# Altium project car BMS.PrjPcb
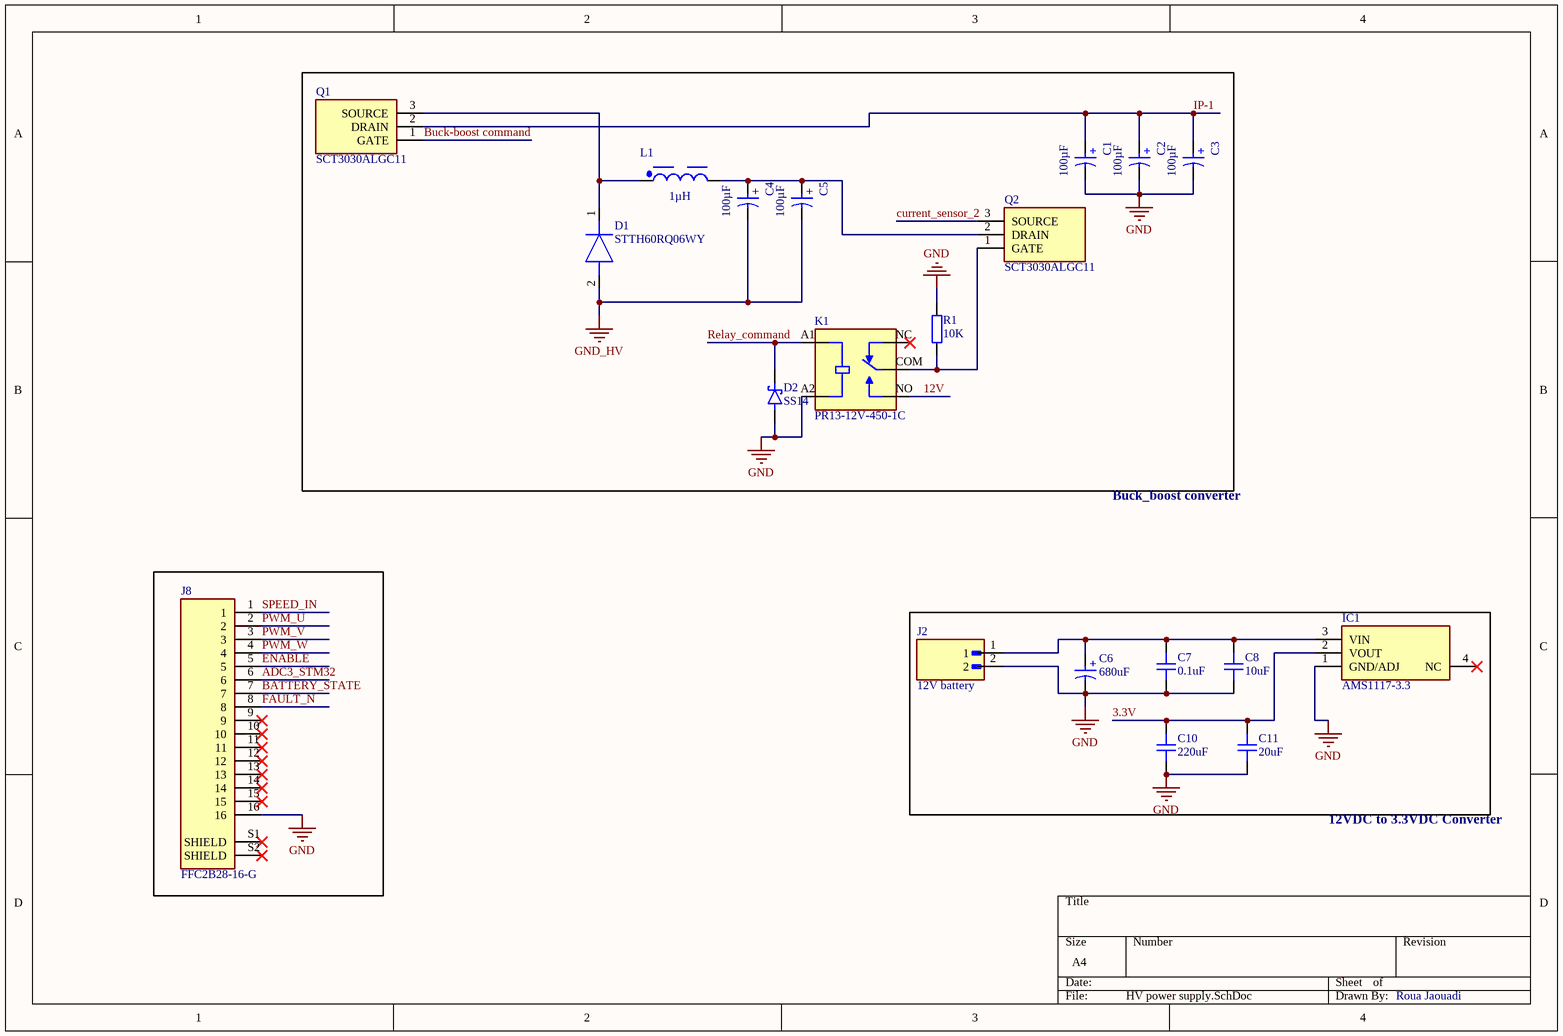
[diagram p0: HV power supply.SchDoc]
4 sheets, 108 parts. Net scope: global (net labels, ports and power ports of the same name join across sheets).
Board file: BMS_PCB.PcbDoc
Sheets:
  HV power supply.SchDoc
  CPU.SchDoc
  Switch mode power supply.SchDoc
  Current sensors.SchDoc

## Sheet HV power supply.SchDoc
size A4; SheetNumber: 1; SheetTotal: 4

### Parts
C1  100µF  [WCAP-AT1H_D16H35.5]
C2  100µF  [WCAP-AT1H_D16H35.5]
C3  100µF  [WCAP-AT1H_D16H35.5]
C4  100µF  [WCAP-AT1H_D16H35.5]
C5  100µF  [WCAP-AT1H_D16H35.5]
C6  680uF  [WCAP-ATG8_D8H16]
C7  0.1uF  [CAP_0603]
C8  10uF  [CAP_1206]
C10  220uF  [CAP-EL-NP-5MM]
C11  20uF  [CAP_1206]
D1  STTH60RQ06WY  [TO1090P515X1560X2445-2P]
D2  SS14  [DIOM4325X250N]
IC1  AMS1117-3.3  [SOT229P700X180-4N]
J2  12V battery  [JST_S2B-XH-A(LF)(SN)]
J8  FFC2B28-16-G  [GCT_FFC2B28-16-G]
K1  PR13-12V-450-1C  [RELAY_PR13-12V-450-1C]
L1  1µH  [WE-HCFT_2504_7443762504010]
Q1  SCT3030ALGC11  [TO545P515X1600X2535-3P]
Q2  SCT3030ALGC11  [TO545P515X1600X2535-3P]
R1  10K  [RES_0603]

### Nets
GND: C1.2(N) C2.2(N) C3.2(N) C6.2(N) C7.2 C8.2 C10.2 C11.2 D2.A IC1.1(GND/ADJ) J2.2 J8.16 K1.A2(COIL2) R1.1
GND_HV: C4.2(N) C5.2(N) D1.2(A)
3.3V: C10.1 C11.1 IC1.2(VOUT)
12V: K1.NO
ADC3_STM32: J8.6
BATTERY_STATE: J8.7
Buck-boost command: Q1.1(GATE)
current_sensor_2: Q2.3(SOURCE)
ENABLE: J8.5
FAULT_N: J8.8
IP-1: C1.1(P) C2.1(P) C3.1(P) Q1.2(DRAIN)
PWM_U: J8.2
PWM_V: J8.3
PWM_W: J8.4
Relay_command: D2.C(K) K1.A1(COIL1)
SPEED_IN: J8.1
NetC4_1: C4.1(P) C5.1(P) L1.2 Q2.2(DRAIN)
NetC6_1: C6.1(P) C7.1 C8.1 IC1.3(VIN) J2.1
NetD1_1: D1.1(K) L1.1 Q1.3(SOURCE)
NetK1_COM: K1.COM Q2.1(GATE) R1.2

Not connected (* = marked no-connect by the designer): IC1 4(NC)*; J8 9* 10* 11* 12* 13* 14* 15* S1(SHIELD)* S2(SHIELD)*; K1 NC*

### Notes on the sheet
- Buck_boost converter
- 12VDC to 3.3VDC Converter
- Roua Jaouadi
- (in symbol 860010374014) +
- (in symbol 860241480001) +

### Library data of the parts
C1-C5 = 860241480001: WCAP-AT1H Aluminum Electrolytic Capacitor, Radial, D16 x H35.5mm, 100µF, 450V; Manufacturer: Wurth Elektronik; Capacitance Tolerance: +/-20%; Dissipation Factor: 17%; Endurance: 5000h; Leakage Current: 1900µA; Ripple Current: 610mA; Technical Reference: ATJK355101M450DSPADE000; Manufacturer Part Number: 860241480001; Category: Aluminum Electrolytic Capacitors; Match Code: WCAP-AT1H; ComponentLink1Description: Website Link; ComponentLink1URL: https://www.we-online.com/redexpert/article/860241480001?ad; ComponentLink2Description: Datasheet Link; ComponentLink2URL: https://www.we-online.com/redexpert/spec/860241480001?ad; Mount: Through Hole; Min Operating Temperature: -25°C; Max Operating Temperature: 105°C; Packaging: Ammo Pack; Case/Size Code: D16 x H35.5mm; Height: 35.5mm; Diameter: 16mm; Capacitance: 100µF; Rated Voltage (DC): 450V
C6 = 860010374014: WCAP-ATG8 Aluminum Electrolytic Capacitor, Radial, THT, D8 x H16mm, 680uF, 16V; Manufacturer: Wurth Elektronik; Capacitance Tolerance: +/-20%; Dissipation Factor: 16%; Endurance: 2000h; Leakage Current: 108.8uA; Ripple Current: 640mA; Technical Reference: ATBE160681M016DSPA7B000; Manufacturer Part Number: 860010374014; Category: Aluminum Electrolytic Capacitors; Match Code: WCAP-ATG8; ComponentLink1Description: Website Link; ComponentLink1URL: https://www.we-online.com/redexpert/article/860010374014?ad; ComponentLink2Description: Datasheet Link; ComponentLink2URL: https://www.we-online.com/redexpert/spec/860010374014?ad; Mount: Through Hole; Operating Temperature Max: 85°C; Operating Temperature Min: -40°C; Packaging: Ammo Pack; Height: 16mm; Diameter: 8mm; Capacitance: 680uF; Rated Voltage (DC): 16V
C7 = CAP_0603: Capacitor SMD 0603; Manufacturer: *; Manufacturer Part Number: *; Distributor Link: *; LCSC: *; Rating: *; Dielectric: *
C8 C11 = CAP_1206: Capacitor SMD 1206; Manufacturer: *; Manufacturer Part Number: *; Distributor Link: *; LCSC: *; Rating: *; Dielectric: *
C10 = CAP_EL_NP_5MM: Capacitor SMD Electrolytic Non-Polarised 5mm Diameter; Manufacturer: Nichicon; Manufacturer Part Number: *
D1 = STTH60RQ06WY: Diode; Manufacturer_Name: STMicroelectronics; Datasheet Link: https://www.st.com/resource/en/datasheet/stth60rq06-y.pdf; Height: 5.15mm; Manufacturer_Part_Number: STTH60RQ06WY; Mouser Part Number: 511-STTH60RQ06WY; Mouser Price/Stock: https://www.mouser.co.uk/ProductDetail/STMicroelectronics/STTH60RQ06WY?qs=MLItCLRbWsyVCwranNoGkg%3D%3D
D2 = SS14: 1A, 40V, Schottky Rectifier; MF: Taiwan Semiconductor; SnapEDA_Link: https://www.snapeda.com/parts/SS14/taiwan/view-part/?ref=snap; Package: SMA-2 Taiwan Semiconductor; Value: *; MP: SS14; Check_prices: https://www.snapeda.com/parts/SS14/taiwan/view-part/?ref=eda
IC1 = AMS1117-3.3: Integrated Circuit; Manufacturer_Name: Advanced; Datasheet Link: https://datasheet.datasheetarchive.com/originals/distributors/Datasheets-28/DSA-550594.pdf; Height: 1.8mm; Manufacturer_Part_Number: AMS1117-3.3
J2 = S2B-XH-A(LF)(SN): Connector Header Through Hole, Right Angle 2 position 0.098 (2.50mm); MF: JST Sales; SnapEDA_Link: https://www.snapeda.com/parts/S2B-XH-A(LF)(SN)/JST/view-part/?ref=snap; Package: None; Value: *; MP: S2B-XH-A(LF)(SN); Check_prices: https://www.snapeda.com/parts/S2B-XH-A(LF)(SN)/JST/view-part/?ref=eda
J8 = FFC2B28-16-G: 16 Position FFC, FPC Connector Contacts, Top and Bottom 0.020 (0.50mm) Surface Mount, Right Angle; MF: Global Connector Technology; SnapEDA_Link: https://www.snapeda.com/parts/FFC2B28-16-G/Global+Connector+Technology/view-part/?ref=snap; Package: None; Value: *; MP: FFC2B28-16-G; Check_prices: https://www.snapeda.com/parts/FFC2B28-16-G/Global+Connector+Technology/view-part/?ref=eda
K1 = PR13-12V-450-1C: 19 x 15.5 x 15.8 mm, 12 V, 10 A, SPDT (1 Form C), Power Relay; MF: Same Sky; SnapEDA_Link: https://www.snapeda.com/parts/PR13-12V-450-1C/Same+Sky/view-part/?ref=snap; Package: None; Value: *; MP: PR13-12V-450-1C; Check_prices: https://www.snapeda.com/parts/PR13-12V-450-1C/Same+Sky/view-part/?ref=eda
L1 = 7443762504010: WE-HCFT THT High Current Inductor, size 2504, 1µH, 39A; Manufacturer: Wurth Elektronik; Case/Size Code: 2504; DC Resistance: 0.86mΩ; DC Resistance Max: 0.95mΩ; Inductance Tolerance: 20%; Saturation Current: 33A; Self Resonant Frequency: 38MHz; Manufacturer Part Number: 7443762504010; Category: Power Inductors; Match Code: WE-HCFT; ComponentLink1Description: Website Link; ComponentLink1URL: https://www.we-online.com/redexpert/article/7443762504010?ad; ComponentLink2Description: Datasheet Link; ComponentLink2URL: https://www.we-online.com/redexpert/spec/7443762504010?ad; Mount: Through Hole; Min Operating Temperature: -40°C; Max Operating Temperature: 125°C; Packaging: Tray; Length: 22mm; Width: 25.7mm; Height: 4.1mm; Inductance: 1µH; Rated Current: 39A
Q1 Q2 = SCT3030ALGC11: Transistor; Manufacturer_Name: ROHM Semiconductor; Datasheet Link: https://datasheet.datasheetarchive.com/originals/distributors/DKDS-18/357094.pdf; Height: 5.15mm; Manufacturer_Part_Number: SCT3030ALGC11; Mouser Part Number: 755-SCT3030ALGC11; Mouser Price/Stock: https://www.mouser.co.uk/ProductDetail/ROHM-Semiconductor/SCT3030ALGC11?qs=tlR8i4ZVbUfmf0QVOgVHPA%3D%3D
R1 = RES_0603: Resistor SMD 0603; Manufacturer: *; Manufacturer Part Number: *; Distributor Link: *; LCSC: *

## Sheet CPU.SchDoc
size A4; SheetNumber: 2; SheetTotal: 4
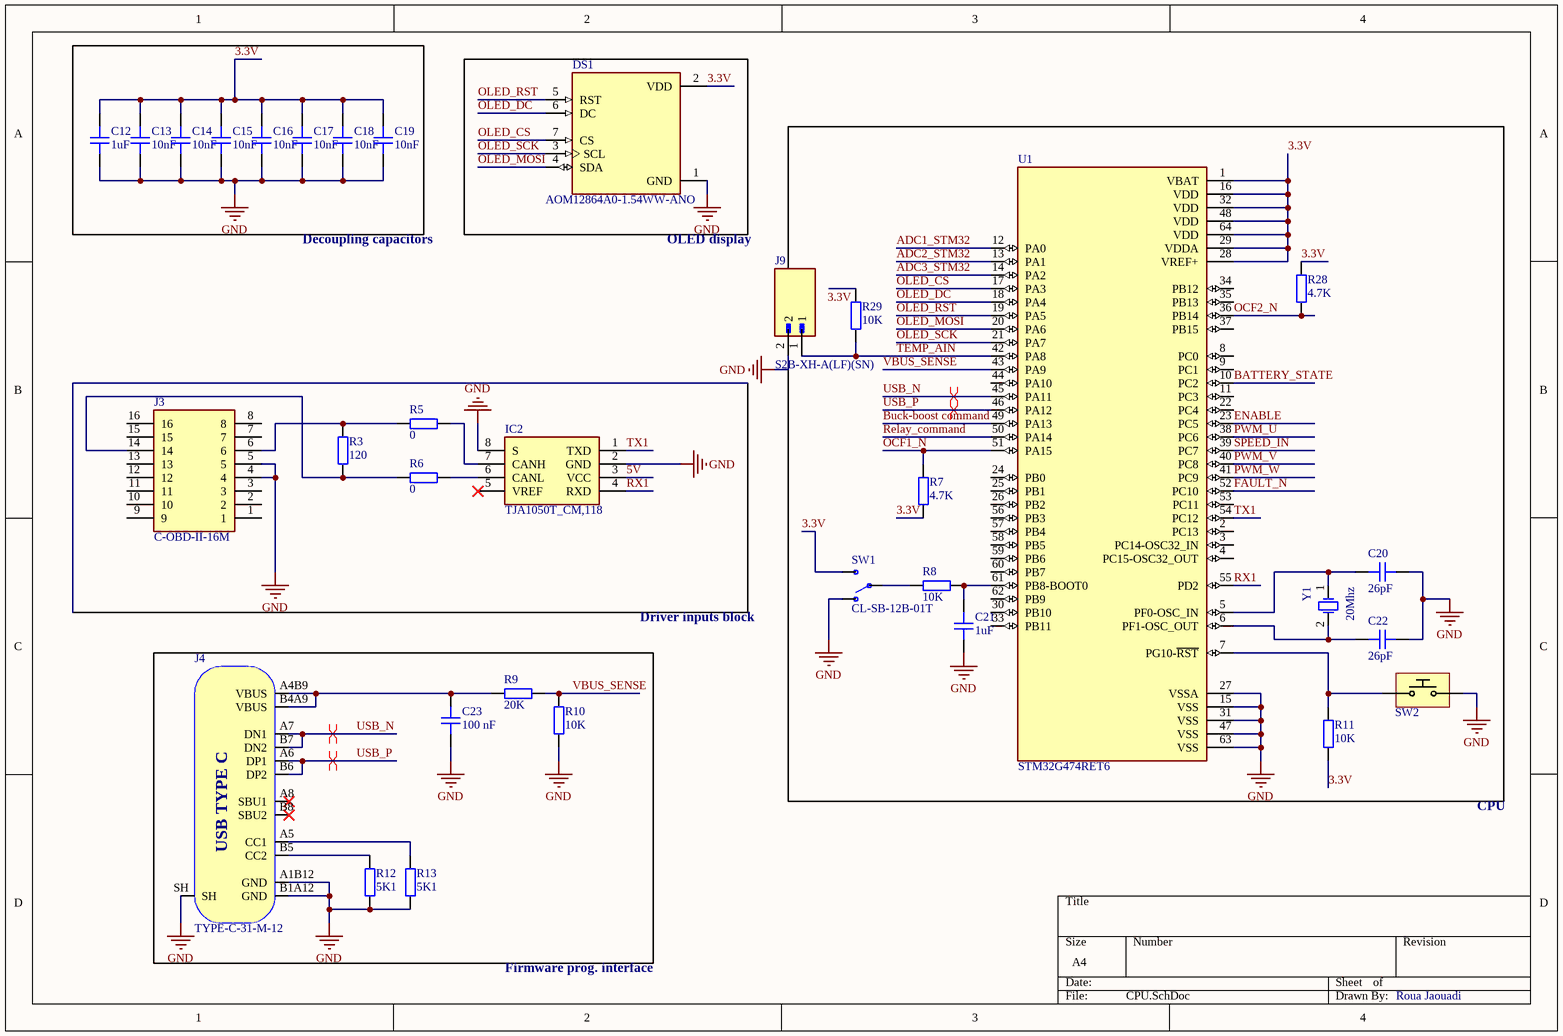
[diagram p1: CPU.SchDoc]

### Parts
C12  1uF  [CAP_0603]
C13  10nF  [CAP_0603]
C14  10nF  [CAP_0603]
C15  10nF  [CAP_0603]
C16  10nF  [CAP_0603]
C17  10nF  [CAP_0603]
C18  10nF  [CAP_0603]
C19  10nF  [CAP_0603]
C20  26pF  [CAP_0603]
C21  1uF  [CAP_0603]
C22  26pF  [CAP_0603]
C23  100 nF  [CAP_0603]
DS1  AOM12864A0-1.54WW-ANO  [LCD_AOM12864A0-1.54WW-ANO]
IC2  TJA1050T_CM,118  [SOIC127P600X175-8N]
J3  C-OBD-II-16M  [COMTECH_C-OBD-II-16M]
J4  TYPE-C-31-M-12  [TYPE-C-31-M-12]
J9  S2B-XH-A(LF)(SN)  [JST_S2B-XH-A(LF)(SN)]
R3  120  [RES_0603]
R5  0  [RES_0603]
R6  0  [RES_0603]
R7  4.7K  [RES_0402]
R8  10K  [RES_0402]
R9  20K  [RES_0402]
R10  10K  [RES_0402]
R11  10K  [RES_0402]
R12  5K1  [RES_0402]
R13  5K1  [RES_0402]
R28  4.7K  [RES_0402]
R29  10K  [RES_0402]
SW1  CL-SB-12B-01T  [CL-SB-12B-01T]
SW2  Tactile Switch  [PTS815]  (value not drawn)
U1  STM32G474RET6  [QFP50P1200X1200X160-64N]
Y1  20Mhz  [WE-XTAL_HC49/4HSMX]

### Nets
GND: C12.2 C13.2 C14.2 C15.2 C16.2 C17.2 C18.2 C19.2 C20.2 C21.2 C22.2 C23.2 DS1.1(GND) IC2.2(GND) IC2.8(S) J3.4 J3.5 J4.A1B12(GND) J4.B1A12(GND) J4.SH J9.2 R10.2 R12.2 R13.2 SW1.1 SW2.2 U1.15(VSS) U1.27(VSSA) U1.31(VSS) U1.47(VSS) U1.63(VSS)
3.3V: C12.1 C13.1 C14.1 C15.1 C16.1 C17.1 C18.1 C19.1 DS1.2(VDD) R7.2 R11.2 R28.1 R29.2 SW1.3 U1.1(VBAT) U1.16(VDD) U1.28(VREF+) U1.29(VDDA) U1.32(VDD) U1.48(VDD) U1.64(VDD)
5V: IC2.3(VCC)
ADC1_STM32: U1.12(PA0)
ADC2_STM32: U1.13(PA1)
ADC3_STM32: U1.14(PA2)
BATTERY_STATE: U1.10(PC2)
Buck-boost command: U1.49(PA13)
ENABLE: U1.23(PC5)
FAULT_N: U1.52(PC10)
OCF1_N: R7.1 U1.51(PA15)
OCF2_N: R28.2 U1.36(PB14)
OLED_CS: DS1.7(CS) U1.17(PA3)
OLED_DC: DS1.6(DC) U1.18(PA4)
OLED_MOSI: DS1.4(SDA) U1.20(PA6)
OLED_RST: DS1.5(RST) U1.19(PA5)
OLED_SCK: DS1.3(SCL) U1.21(PA7)
PWM_U: U1.38(PC6)
PWM_V: U1.40(PC8)
PWM_W: U1.41(PC9)
Relay_command: U1.50(PA14)
RX1: IC2.4(RXD) U1.55(PD2)
SPEED_IN: U1.39(PC7)
TEMP_AIN: J9.1 R29.1 U1.42(PA8)
TX1: IC2.1(TXD) U1.54(PC12)
USB_N: J4.A7(DN1) J4.B7(DN2) U1.45(PA11)
USB_P: J4.A6(DP1) J4.B6(DP2) U1.46(PA12)
VBUS_SENSE: R9.2 R10.1 U1.43(PA9)
NetC20_1: C20.1 U1.5(PF0-OSC_IN) Y1.1(OSC1)
NetC21_1: C21.1 R8.2 U1.61(PB8-BOOT0)
NetC22_1: C22.1 U1.6(PF1-OSC_OUT) Y1.2(OSC2)
NetC23_1: C23.1 J4.A4B9(VBUS) J4.B4A9(VBUS) R9.1
NetIC2_6: IC2.6(CANL) R6.2
NetIC2_7: IC2.7(CANH) R5.2
NetJ3_6: J3.6 R3.1 R5.1
NetJ3_14: J3.14 R3.2 R6.1
NetJ4_A5: J4.A5(CC1) R13.1
NetJ4_B5: J4.B5(CC2) R12.1
NetR8_1: R8.1 SW1.C
NetR11_1: R11.1 SW2.1 U1.7(PG10-~{RST})

Not connected (* = marked no-connect by the designer): IC2 5(VREF)*; J3 1 2 3 7 8 9 10 11 12 13 15 16; J4 A8(SBU1)* B8(SBU2)*; U1 2(PC13) 3(PC14-OSC32_IN) 4(PC15-OSC32_OUT) 8(PC0) 9(PC1) 11(PC3) 22(PC4) 24(PB0) 25(PB1) 26(PB2) 30(PB10) 33(PB11) 34(PB12) 35(PB13) 37(PB15) 44(PA10) 53(PC11) 56(PB3) 57(PB4) 58(PB5) 59(PB6) 60(PB7) 62(PB9)

### Layout directives
differential pair: USB_N, USB_P

### Notes on the sheet
- Decoupling capacitors
- (near DS1) OLED display
- Driver inputs block
- CPU
- Firmware prog. interface
- Roua Jaouadi
- (in symbol TYPE-C-31-M-12) USB TYPE C

### Library data of the parts
C12-C23 = CAP_0603: Capacitor SMD 0603; Manufacturer: *; Manufacturer Part Number: *; Distributor Link: *; LCSC: *; Rating: *; Dielectric: *
DS1 = AOM12864A0-1.54WW-ANO: Non-Touch Graphic LCD Display Module - White OLED SPI 1.54 (39.12mm) 128 x 64; MF: Orient Display; SnapEDA_Link: https://www.snapeda.com/parts/AOM12864A0-1.54WW-ANO/Orient+Display/view-part/?ref=snap; Package: None; Value: *; MP: AOM12864A0-1.54WW-ANO; Check_prices: https://www.snapeda.com/parts/AOM12864A0-1.54WW-ANO/Orient+Display/view-part/?ref=eda
IC2 = TJA1050T_CM,118: Integrated Circuit; Manufacturer_Name: NXP; Manufacturer_Part_Number: TJA1050T/CM,118; Datasheet Link: http://www.nxp.com/docs/en/data-sheet/TJA1050.pdf; Height: 1.75mm; Mouser Part Number: 771-TJA1050T/CM118; Mouser Price/Stock: https://www.mouser.co.uk/ProductDetail/NXP-Semiconductors/TJA1050T-CM118?qs=5XOdhvmYM0NFFspw0VP5sA%3D%3D; Arrow Part Number: TJA1050T/CM,118; Arrow Price/Stock: https://www.arrow.com/en/products/tja1050tcm118/nxp-semiconductors?utm_currency=USD&region=europe
J3 = C-OBD-II-16M: OBD II 16pin 90 Degree Angle Male Plug Connector; MF: Comtech Electronic Co., LTD; SnapEDA_Link: https://www.snapeda.com/parts/C-OBD-II-16M/Comtech+Electronic+Co.%252C+LTD/view-part/?ref=snap; Package: None; Value: *; MP: C-OBD-II-16M; Check_prices: https://www.snapeda.com/parts/C-OBD-II-16M/Comtech+Electronic+Co.%252C+LTD/view-part/?ref=eda
J4 = TYPE-C-31-M-12: USB Type C Connector Horizontal SMT; Manufacturer: Koren Hroparts; Manufacturer Part Number: TYPE-C-31-M-12
J9 = S2B-XH-A(LF)(SN): as J2 on sheet HV power supply; SnapEDA_Link: https://www.snapeda.com/parts/S2B-XH-A(LF)(SN)/JST/view-part/?ref=snap; Package: None; Value: *; MP: S2B-XH-A(LF)(SN); Check_prices: https://www.snapeda.com/parts/S2B-XH-A(LF)(SN)/JST/view-part/?ref=eda
R3 R5 R6 = RES_0603: Resistor SMD 0603; Manufacturer: *; Manufacturer Part Number: *; Distributor Link: *; LCSC: *
R7-R13 R28 R29 = RES_0402: Resistor SMD 0402; Manufacturer: *; Manufacturer Part Number: *; Distributor Link: *; LCSC: *
SW1 = CL-SB-12B-01T: Slide Switch SPDT Surface Mount; MF: Nidec Copal; SnapEDA_Link: https://www.snapeda.com/parts/CL-SB-12B-01T/Nidec/view-part/?ref=snap; Package: None; Value: *; MP: CL-SB-12B-01T; Check_prices: https://www.snapeda.com/parts/CL-SB-12B-01T/Nidec/view-part/?ref=eda
SW2 = PTS815-SJM-250-SMTR-LFS: Tactile Switches Tact Switch, 12 VDC, 50 mA, 4.2x3.2, 2.5mm H, 180gf, J leadspp SPST; Manufacturer: C&K Switches; Manufacturer Part Number: PTS815 SJM 250 SMTR LFS
U1 = STM32G474RET6: ARMÂ® CortexÂ®-M4F STM32G4 Microcontroller IC 32-Bit Single-Core 170MHz 512KB (512K x 8) FLASH 64-LQFP (10x10); MF: STMicroelectronics; SnapEDA_Link: https://www.snapeda.com/parts/STM32G474RET6/STMicroelectronics/view-part/?ref=snap; Package: LQFP-64 STMicroelectronics; Value: *; MP: STM32G474RET6; Check_prices: https://www.snapeda.com/parts/STM32G474RET6/STMicroelectronics/view-part/?ref=eda
Y1 = 830003260: WE-XTAL Quartz Crystal, SMT, HC49/4HSMX, 3.6864 MHz, ±30ppm; Manufacturer: Wurth Elektronik; Frequency Stability: 50ppm; Load Capacitance: 16pF; Manufacturer Part Number: 830003260; Category: Crystals; Match Code: WE-XTAL; ComponentLink1Description: Website Link; ComponentLink1URL: https://www.we-online.com/redexpert/article/830003260?ad; ComponentLink2Description: Datasheet Link; ComponentLink2URL: https://www.we-online.com/redexpert/spec/830003260?ad; Mount: Surface Mount; Min Operating Temperature: -10°C; Max Operating Temperature: 60°C; Packaging: Tape and Reel; Case/Size Code: HC49/4HSMX; Length: 12.4mm; Width: 4.7mm; Height: 4.5mm; Application: Processor, UART; Frequency: 3.6864 MHz; Frequency Tolerance: ±30ppm

## Sheet Switch mode power supply.SchDoc
size A4; SheetNumber: 3; SheetTotal: 4
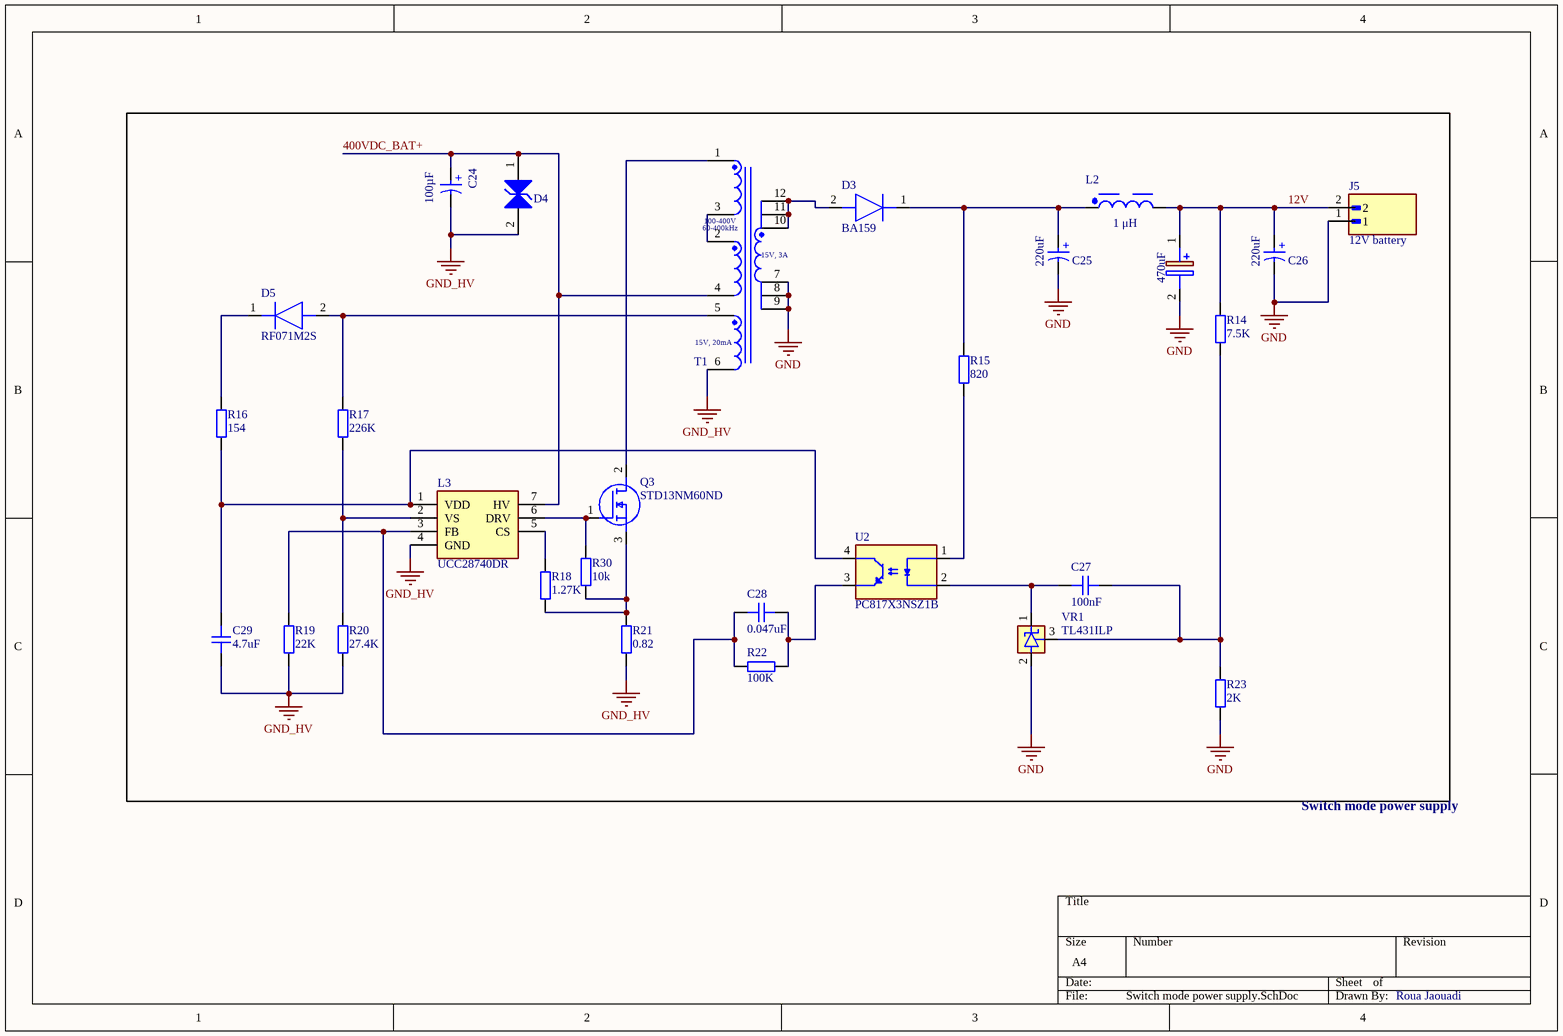
[diagram p2: Switch mode power supply.SchDoc]

### Parts
470uF  UVR1C471MPD  [CAPPRD350W60D825H1300]  (value not drawn)
C24  100µF  [WCAP-AT1H_D16H35.5]
C25  220uF  [WCAP-ATG8_D6.3H11]
C26  220uF  [WCAP-ATG8_D6.3H11]
C27  100nF  [CAP_1206]
C28  0.047uF  [CAP_1206]
C29  4.7uF  [CAP_1206]
D3  BA159  [DIOAD1405W86L465D235]
D4  600W, 5VDC  [WE-TVSP_DO-214AA_Bidirectional]  (value not drawn)
D5  RF071M2S  [RF071M2S]
J5  12V battery  [JST_S2B-XH-A(LF)(SN)]
L2  1 μH  [WE-LHMI_1040]
L3  UCC28740DR  [D(R-PDSO-G7)]
Q3  STD13NM60ND  [STD13NM60ND]
R14  7.5K  [RES_0603]
R15  820  [RES_0603]
R16  154  [RES_0603]
R17  226K  [RES_0603]
R18  1.27K  [RES_0603]
R19  22K  [RES_0603]
R20  27.4K  [RES_0603]
R21  0.82  [RES_0603]
R22  100K  [RES_0603]
R23  2K  [RES_0603]
R30  10k  [RES_0603]
T1  100-400Vin, Uo1 = 15V/3A  [WE-FB_EFD25]  (value not drawn)
U2  PC817X3NSZ1B  [DIP762W50P254L495H455Q4]
VR1  TL431ILP  [VREG_TL431ILP]

### Nets
GND: 470uF.2(-) C25.2(N) C26.2(N) J5.1 R23.1 T1.7 T1.8 T1.9 VR1.2(ANODE)
GND_HV: C24.2(N) C29.1 D4.2 L3.4(GND) R19.1 R20.1 R21.1 T1.6
12V: 470uF.1(+) C26.1(P) J5.2 L2.2 R14.2
400VDC_BAT+: C24.1(P) D4.1 L3.7(HV) T1.4
NetC25_1: C25.1(P) D3.1(K) L2.1 R15.2
NetC27_1: C27.1 R14.1 R23.2 VR1.3(REF)
NetC27_2: C27.2 U2.2(CATHODE) VR1.1(CATHODE)
NetC28_1: C28.1 R22.1 U2.3(EMITTER)
NetC28_2: C28.2 L3.3(FB) R19.2 R22.2
NetC29_2: C29.2 L3.1(VDD) R16.1 U2.4(COLLECTOR)
NetD3_2: D3.2(A) T1.10 T1.11 T1.12
NetD5_1: D5.1(K) R16.2
NetD5_2: D5.2(A) R17.2 T1.5
NetL3_2: L3.2(VS) R17.1 R20.2
NetL3_5: L3.5(CS) R18.1
NetL3_6: L3.6(DRV) Q3.1(G) R30.1
NetQ3_2: Q3.2(D) T1.1
NetQ3_3: Q3.3(S) R18.2 R21.2 R30.2
NetR15_1: R15.1 U2.1(ANODE)
NetT1_2: T1.2 T1.3

### Notes on the sheet
- Switch mode power supply
- Roua Jaouadi
- (in symbol 750311771) 100-400V; 60-400kHz; 15V, 3A; 15V, 20mA
- (in symbol 860010273009) +
- (in symbol 860241480001) +

### Library data of the parts
470uF = UVR1C471MPD: Capacitor Polarised; Manufacturer_Name: Nichicon; Datasheet Link: https://www.nichicon.co.jp/english/series_items/catalog_pdf/e-uvr.pdf; Height: 13mm; Manufacturer_Part_Number: UVR1C471MPD; Arrow Part Number: UVR1C471MPD; Arrow Price/Stock: https://www.arrow.com/en/products/uvr1c471mpd/nichicon
C24 = 860241480001: as C1 on sheet HV power supply; Manufacturer Part Number: 860241480001; Category: Aluminum Electrolytic Capacitors; Match Code: WCAP-AT1H; ComponentLink1Description: Website Link; ComponentLink1URL: https://www.we-online.com/redexpert/article/860241480001?ad; ComponentLink2Description: Datasheet Link; ComponentLink2URL: https://www.we-online.com/redexpert/spec/860241480001?ad; Mount: Through Hole; Min Operating Temperature: -25°C; Max Operating Temperature: 105°C; Packaging: Ammo Pack; Case/Size Code: D16 x H35.5mm; Height: 35.5mm; Diameter: 16mm; Capacitance: 100µF; Rated Voltage (DC): 450V
C25 C26 = 860010273009: WCAP-ATG8 Aluminum Electrolytic Capacitor, Radial, THT, D6.3 x H11mm, 220uF, 10V; Manufacturer: Wurth Elektronik; Capacitance Tolerance: +/-20%; Dissipation Factor: 19%; Endurance: 2000h; Leakage Current: 22uA; Ripple Current: 294mA; Technical Reference: ATBD110221M010DSPA4B000; Manufacturer Part Number: 860010273009; Category: Aluminum Electrolytic Capacitors; Match Code: WCAP-ATG8; ComponentLink1Description: Website Link; ComponentLink1URL: https://www.we-online.com/redexpert/article/860010273009?ad; ComponentLink2Description: Datasheet Link; ComponentLink2URL: https://www.we-online.com/redexpert/spec/860010273009?ad; Mount: Through Hole; Operating Temperature Max: 85°C; Operating Temperature Min: -40°C; Packaging: Ammo Pack; Height: 11mm; Diameter: 6.3mm; Capacitance: 220uF; Rated Voltage (DC): 10V
C27-C29 = CAP_1206: Capacitor SMD 1206; Manufacturer: *; Manufacturer Part Number: *; Distributor Link: *; LCSC: *; Rating: *; Dielectric: *
D3 = BA159: Diode; Manufacturer_Name: Rectron; Datasheet Link: http://pdf1.alldatasheet.com/datasheet-pdf/view/14648/PANJIT/BA159.html; Manufacturer_Part_Number: BA159; Mouser Part Number: 583-BA159; Mouser Price/Stock: https://www.mouser.co.uk/ProductDetail/Rectron/BA159?qs=7pEAo90IqNFl%2FmbY1pJmIw%3D%3D
D4 = 824521500: WE-TVSP SMT Power TVS Diode, DO-214AA, Bidirectional, 600W, 5VDC; Manufacturer: Wurth Elektronik; Clamping Voltage: 9.2V; Operating Voltage (DC): 5V; (Reverse) Breakdown Voltage: 6.7V; (Reverse) Peak Pulse Current: 65.3A; ComponentLink1Description: Website Link; ComponentLink1URL: https://www.we-online.com/redexpert/article/824521500?ad; ComponentLink2Description: Datasheet Link; ComponentLink2URL: https://www.we-online.com/redexpert/spec/824521500?ad; Manufacturer Part Number: 824521500; Category: Surge Protection; Match Code: WE-TVSP; Mount: Surface Mount; Operating Temperature Max: 150°C; Operating Temperature Min: -65°C; Packaging: Tape and Reel; Case/Size Code: DO-214AA; Length: 4.32mm; Width: 3.62mm; Height: 2.4mm; Polarity: Bidirectional; Power Dissipation: 600W
D5 = RF071M2S: Diode; Manufacturer_Name: ROHM Semiconductor; Datasheet Link: http://rohmfs.rohm.com/en/products/databook/datasheet-nrnd/discrete/diode/fast_recovery/rf071m2s.pdf; Height: 0.9mm; Manufacturer_Part_Number: RF071M2S; Mouser Part Number: N/A; Mouser Price/Stock: https://www.mouser.co.uk/ProductDetail/ROHM-Semiconductor/RF071M2S?qs=OfeFRKQgECgpuFmwKn2lvw%3D%3D
J5 = S2B-XH-A(LF)(SN): as J2 on sheet HV power supply; SnapEDA_Link: https://www.snapeda.com/parts/S2B-XH-A(LF)(SN)/JST/view-part/?ref=snap; Package: None; Value: *; MP: S2B-XH-A(LF)(SN); Check_prices: https://www.snapeda.com/parts/S2B-XH-A(LF)(SN)/JST/view-part/?ref=eda
L2 = 74437368010: WE-LHMI SMT Power Inductor, size 1040, 1 μH, 21.3 A, 3.3 mΩ; Manufacturer: Wurth Elektronik; Case/Size Code: 1040; DC Resistance Max: 3.3 mΩ; Performance Rated Current: 21.3 A; Saturation Current @ 10%: 22.7 A; Saturation Current @ 30%: 48.3 A; Self Resonant Frequency: 45 MHz; Manufacturer Part Number: 74437368010; Category: Power Inductors; Match Code: WE-LHMI; ComponentLink1Description: Website Link; ComponentLink1URL: https://www.we-online.com/redexpert/article/74437368010?ad; ComponentLink2Description: Datasheet Link; ComponentLink2URL: https://www.we-online.com/redexpert/spec/74437368010?ad; Mount: Surface Mount; Min Operating Temperature: -40 °C; Max Operating Temperature: 125 °C; Packaging: Tape and Reel; Length: 11 mm; Width: 10 mm; Height: 3.8 mm; Inductance: 1 μH
L3 = UCC28740DR: Inductor; Manufacturer_Name: Texas Instruments; Datasheet Link: http://www.ti.com/lit/gpn/ucc28740; Manufacturer_Part_Number: UCC28740DR; Mouser Part Number: 595-UCC28740DR; Mouser Price/Stock: https://www.mouser.co.uk/ProductDetail/Texas-Instruments/UCC28740DR?qs=e1ok2LiJcmZNvNsbUBmieA%3D%3D; Arrow Part Number: UCC28740DR; Arrow Price/Stock: https://www.arrow.com/en/products/ucc28740dr/texas-instruments?region=nac
Q3 = STD13NM60ND: MOSFET (N-Channel); Manufacturer_Name: STMicroelectronics; Datasheet Link: https://mm.digikey.com/Volume0/opasdata/d220001/medias/docus/516/STx13NM60ND_DS.pdf; Height: 2.63mm; Manufacturer_Part_Number: STD13NM60ND; Mouser Part Number: 511-STD13NM60ND; Mouser Price/Stock: https://www.mouser.co.uk/ProductDetail/STMicroelectronics/STD13NM60ND?qs=DqCdCwOw4%2F6kZ%252B3qCIf%2FhQ%3D%3D; Arrow Part Number: STD13NM60ND; Arrow Price/Stock: https://www.arrow.com/en/products/std13nm60nd/stmicroelectronics?region=nac
R14-R23 R30 = RES_0603: Resistor SMD 0603; Manufacturer: *; Manufacturer Part Number: *; Distributor Link: *; LCSC: *
T1 = 750311771: WE-FB Flyback Transformer suitable for LT3748, SMT, EFD25, 100-400Vin, Uo1 = 15V/3A, 45W; Manufacturer: Wurth Elektronik; Auxiliary Voltage: 15V; Inductance: 500uH; Input Voltage: 100-400VDC; Insulation Test Voltage: 2000VAC; Leakage Inductance: 10uH; Output Current 1: 3A; Saturation Current: 2.5A; Turns Ratio: 3:3:1:1; Manufacturer Part Number: 750311771; Category: Transformers For DC-DC Converter; Match Code: WE-FB; ComponentLink1Description: Website Link; ComponentLink1URL: https://www.we-online.com/redexpert/article/750311771?ad; ComponentLink2Description: Datasheet Link; ComponentLink2URL: https://www.we-online.com/redexpert/spec/750311771?ad; Mount: Surface Mount; Operating Temperature Max: 125°C; Operating Temperature Min: -40°C; Packaging: Tape and Reel; Case/Size Code: EFD25; Length: 32.31mm; Width: 27.03mm; Height: 13.69mm; IC Reference: LT3748; Output Power: 45W; Output Voltage 1: 15V
U2 = PC817X3NSZ1B: Optoisolator Transistor Output - 1 Channel 4-DIP; MF: Sharp Microelectronics; SnapEDA_Link: https://www.snapeda.com/parts/PC817X3NSZ1B/Sharp+Microelectronics/view-part/?ref=snap; Price: None; Purchase-URL: https://pricing.snapeda.com/search/part/PC817X3NSZ1B/?ref=eda; Check_prices: https://www.snapeda.com/parts/PC817X3NSZ1B/Sharp+Microelectronics/view-part/?ref=eda; MP: PC817X3NSZ1B; Value: *; Availability: In Stock; Package: DIP-4 Sharp Microelectronics
VR1 = TL431ILP: Package: None; Price: None; Value: *; MP: TL431ILP; Availability: Unavailable

## Sheet Current sensors.SchDoc
size A4; SheetNumber: 4; SheetTotal: 4
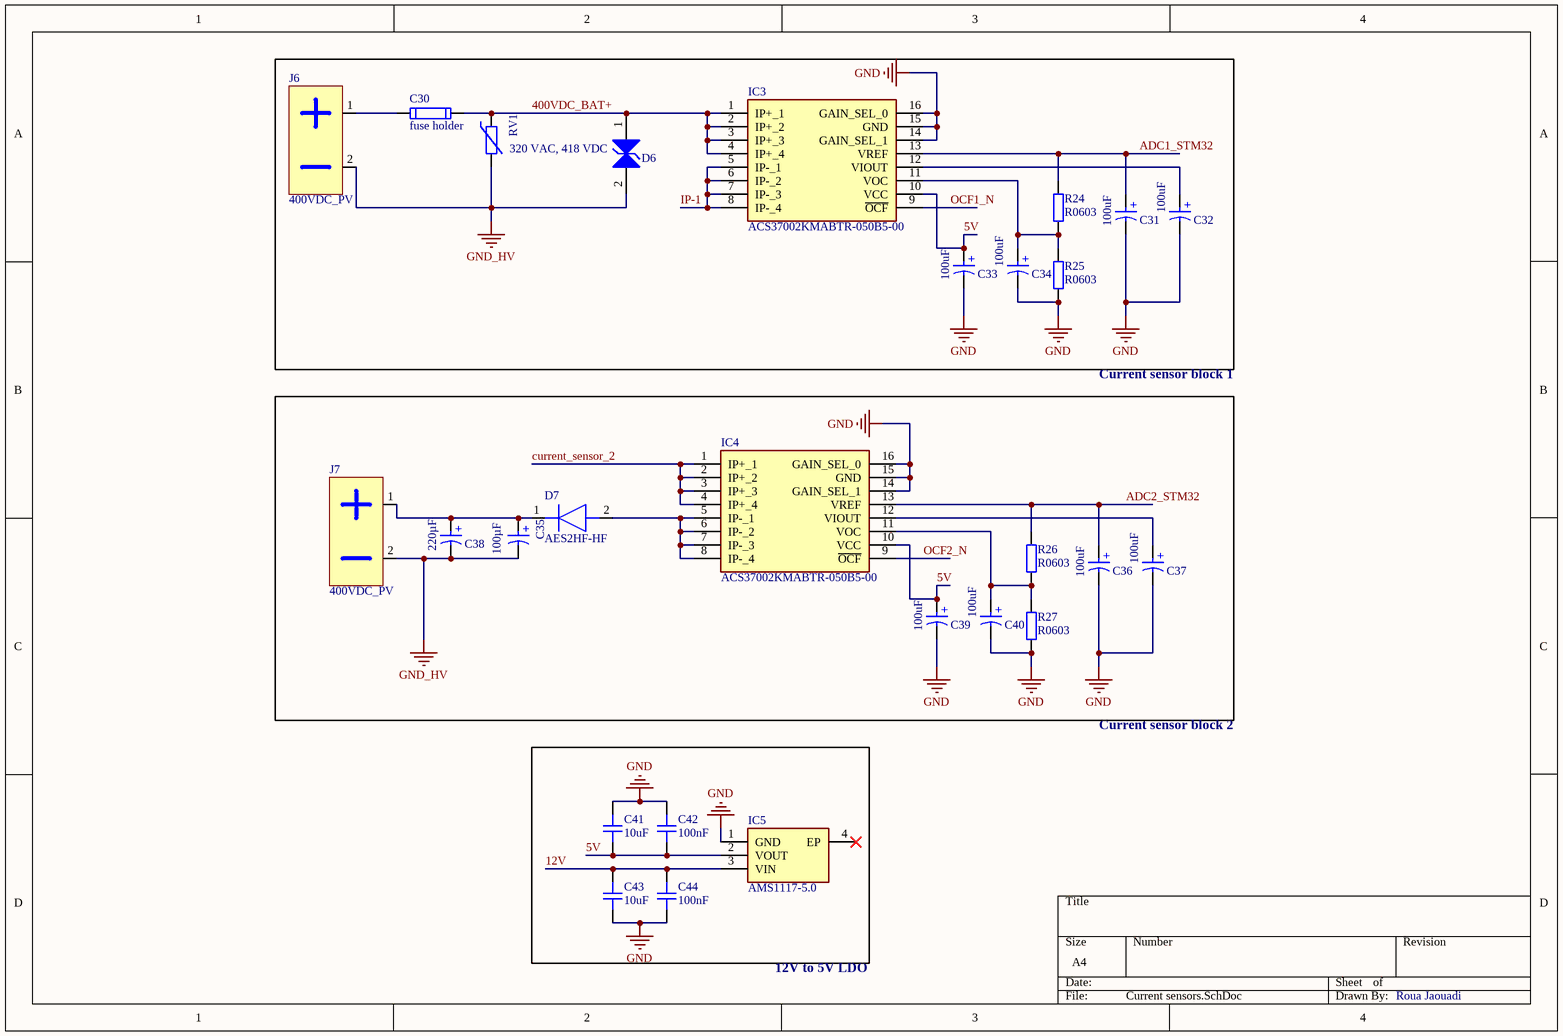
[diagram p3: Current sensors.SchDoc]

### Parts
C30  fuse holder  [696108003002]
C31  100uF  [WCAP-ATG8_D5H11]
C32  100uF  [WCAP-ATG8_D5H11]
C33  100uF  [WCAP-ATG8_D5H11]
C34  100uF  [WCAP-ATG8_D5H11]
C35  100µF  [WCAP-AT1H_D16H35.5]
C36  100uF  [WCAP-ATG8_D5H11]
C37  100uF  [WCAP-ATG8_D5H11]
C38  220µF  [WCAP-AIE8_D25H40]
C39  100uF  [WCAP-ATG8_D5H11]
C40  100uF  [WCAP-ATG8_D5H11]
C41  10uF  [CAP_0603]
C42  100nF  [CAP_0603]
C43  10uF  [CAP_0603]
C44  100nF  [CAP_0603]
D6  600W, 5VDC  [WE-TVSP_DO-214AA_Bidirectional]  (value not drawn)
D7  AES2HF-HF  [SODFL5226X110N]
IC3  ACS37002KMABTR-050B5-00  [SOIC127P1030X265-16N]
IC4  ACS37002KMABTR-050B5-00  [SOIC127P1030X265-16N]
IC5  AMS1117-5.0  [SOT290P700X180-4N]
J6  400VDC_PV  [XT60PW-F]
J7  400VDC_PV  [XT60PW-F]
R24  R0603  [RES_0603]
R25  R0603  [RES_0603]
R26  R0603  [RES_0603]
R27  R0603  [RES_0603]
RV1  320 VAC, 418 VDC  [D16.5W7.2H20.5P1.6]

### Blocks framed on the sheet
Current sensor block 1: C35-C40 D7 IC4 J7 R26 R27

### Nets
GND: C31.2(N) C32.2(N) C33.2(N) C34.2(N) C36.2(N) C37.2(N) C39.2(N) C40.2(N) C41.1 C42.1 C43.2 C44.2 IC3.14(GAIN_SEL_1) IC3.15(GND) IC3.16(GAIN_SEL_0) IC4.14(GAIN_SEL_1) IC4.15(GND) IC4.16(GAIN_SEL_0) IC5.1(GND) R25.2 R27.2
GND_HV: C35.2(N) C38.2(N) D6.2 J6.2(V-) J7.2(V-) RV1.2
5V: C33.1(P) C39.1(P) C41.2 C42.2 IC3.10(VCC) IC4.10(VCC) IC5.2(VOUT)
12V: C43.1 C44.1 IC5.3(VIN)
400VDC_BAT+: C30.2 D6.1 IC3.1(IP+_1) IC3.2(IP+_2) IC3.3(IP+_3) IC3.4(IP+_4) RV1.1
ADC1_STM32: C31.1(P) IC3.13(VREF) R24.1
ADC2_STM32: C36.1(P) IC4.13(VREF) R26.1
current_sensor_2: IC4.1(IP+_1) IC4.2(IP+_2) IC4.3(IP+_3) IC4.4(IP+_4)
IP-1: IC3.5(IP-_1) IC3.6(IP-_2) IC3.7(IP-_3) IC3.8(IP-_4)
OCF1_N: IC3.9(~{OCF})
OCF2_N: IC4.9(~{OCF})
NetC30_1: C30.1 J6.1(V+)
NetC32_1: C32.1(P) IC3.12(VIOUT)
NetC34_1: C34.1(P) IC3.11(VOC) R24.2 R25.1
NetC35_1: C35.1(P) C38.1(P) D7.1(K) J7.1(V+)
NetC37_1: C37.1(P) IC4.12(VIOUT)
NetC40_1: C40.1(P) IC4.11(VOC) R26.2 R27.1
NetD7_2: D7.2(A) IC4.5(IP-_1) IC4.6(IP-_2) IC4.7(IP-_3) IC4.8(IP-_4)

Not connected (* = marked no-connect by the designer): IC5 4(EP)*

### Notes on the sheet
- Current sensor block 2
- 12V to 5V LDO
- Roua Jaouadi
- (in symbol 860010272005) +
- (in symbol 860241480001) +
- (in symbol 861221484011) +

### Library data of the parts
C30 = WE-FUSEHOLDER BLOCKS 696108003002: FUSEHOLDER BLOCKS - PCB - CLIP COVER - THT - WR-FSH; Manufacturer: W¨¹rth Elektronik eiSos GmbH; ComponentLink1 Description: Manufacturer; ComponentLink2 Description: Datasheet; NoPins: 2; ComponentLink1URL: http://www.we-online.de; ComponentLink2URL: http://katalog.we-online.de/em/datasheet/696108003002.pdf; Created by: Karrer Zheng; Created Date: 11/11/2014; partNo: 696108003002
C31-C34 C36 C37 C39 C40 = 860010272005: WCAP-ATG8 Aluminum Electrolytic Capacitor, Radial, THT, D5 x H11mm, 100uF, 10V; Manufacturer: Wurth Elektronik; Capacitance Tolerance: +/-20%; Dissipation Factor: 19%; Endurance: 2000h; Leakage Current: 10uA; Ripple Current: 198mA; Technical Reference: ATBC110101M010DSPA3B000; Manufacturer Part Number: 860010272005; Category: Aluminum Electrolytic Capacitors; Match Code: WCAP-ATG8; ComponentLink1Description: Website Link; ComponentLink1URL: https://www.we-online.com/redexpert/article/860010272005?ad; ComponentLink2Description: Datasheet Link; ComponentLink2URL: https://www.we-online.com/redexpert/spec/860010272005?ad; Mount: Through Hole; Operating Temperature Max: 85°C; Operating Temperature Min: -40°C; Packaging: Ammo Pack; Height: 11mm; Diameter: 5mm; Capacitance: 100uF; Rated Voltage (DC): 10V
C35 = 860241480001: as C1 on sheet HV power supply; Manufacturer Part Number: 860241480001; Category: Aluminum Electrolytic Capacitors; Match Code: WCAP-AT1H; ComponentLink1Description: Website Link; ComponentLink1URL: https://www.we-online.com/redexpert/article/860241480001?ad; ComponentLink2Description: Datasheet Link; ComponentLink2URL: https://www.we-online.com/redexpert/spec/860241480001?ad; Mount: Through Hole; Min Operating Temperature: -25°C; Max Operating Temperature: 105°C; Packaging: Ammo Pack; Case/Size Code: D16 x H35.5mm; Height: 35.5mm; Diameter: 16mm; Capacitance: 100µF; Rated Voltage (DC): 450V
C38 = 861221484011: WCAP-AIE8 Aluminum Electrolytic Capacitor, Snap-In, D25 x H40mm, 220µF, 450V; Manufacturer: Wurth Elektronik; Capacitance Tolerance: +/-20%; Dissipation Factor: 20%; Endurance: 3000h; Leakage Current: 943.93µA; Ripple Current: 1590mA; Technical Reference: ANAO400221M450DSIC3C000; Manufacturer Part Number: 861221484011; Category: Aluminum Electrolytic Capacitors; Match Code: WCAP-AIE8; ComponentLink1Description: Website Link; ComponentLink1URL: https://www.we-online.com/redexpert/article/861221484011?ad; ComponentLink2Description: Datasheet Link; ComponentLink2URL: https://www.we-online.com/redexpert/spec/861221484011?ad; Mount: Through Hole; Operating Temperature Max: 85°C; Operating Temperature Min: -25°C; Packaging: Tray; Height: 40mm; Diameter: 25mm; Capacitance: 220µF; Rated Voltage (DC): 450V
C41-C44 = CAP_0603: Capacitor SMD 0603; Manufacturer: *; Manufacturer Part Number: *; Distributor Link: *; LCSC: *; Rating: *; Dielectric: *
D6 = 824521500: as D4 on sheet Switch mode power supply; ComponentLink1Description: Website Link; ComponentLink1URL: https://www.we-online.com/redexpert/article/824521500?ad; ComponentLink2Description: Datasheet Link; ComponentLink2URL: https://www.we-online.com/redexpert/spec/824521500?ad; Manufacturer Part Number: 824521500; Category: Surge Protection; Match Code: WE-TVSP; Mount: Surface Mount; Operating Temperature Max: 150°C; Operating Temperature Min: -65°C; Packaging: Tape and Reel; Case/Size Code: DO-214AA; Length: 4.32mm; Width: 3.62mm; Height: 2.4mm; Polarity: Bidirectional; Power Dissipation: 600W
D7 = AES2HF-HF: Diode; Manufacturer_Name: Comchip Technology; Datasheet Link: https://www.comchiptech.com/product.php?id=12661; Height: 1.1mm; Manufacturer_Part_Number: AES2HF-HF; Mouser Part Number: 750-AES2HF-HF; Mouser Price/Stock: https://www.mouser.co.uk/ProductDetail/Comchip-Technology/AES2HF-HF?qs=GBLSl2Akirufo1pW%252B4BBNA%3D%3D
IC3 IC4 = ACS37002KMABTR-050B5-00: Integrated Circuit; Manufacturer_Name: Allegro Microsystems; Datasheet Link: https://www.allegromicro.com/en/products/sense/current-sensor-ics/zero-to-fifty-amp-integrated-conductor-sensor-ics/acs37002; Height: 2.65mm; Manufacturer_Part_Number: ACS37002KMABTR-050B5-00
IC5 = AMS1117-5.0: Integrated Circuit; Manufacturer_Name: Shikues; Datasheet Link: https://datasheet.lcsc.com/szlcsc/SK-AMS1117-5-0_C165483.pdf; Height: 1.8mm; Manufacturer_Part_Number: AMS1117-5.0
J6 J7 = XT60PW-F: XT60 horizontal female 2-pin AMASS; Manufacturer: AMASS; Manufacturer Part Number: XT60PW-F; Distributor Link: https://www.tme.eu/de/details/xt60pw-f/dc-steckverbinder/amass/
R24-R27 = RES_0603: Resistor SMD 0603; Manufacturer: *; Manufacturer Part Number: *; Distributor Link: *; LCSC: *
RV1 = 820443211E: WE-VD Disk Varistor, D16.5 x H20.5 mm, 320 VAC, 418 VDC; Manufacturer: Wurth Elektronik; Channel Input Capacitance: 370 pF; Clamping Voltage: 842 V; Energy Absorption: 190 J; Operating Voltage (AC): 320 V; Operating Voltage (DC): 418 V; Power Dissipation: 0.6 W; (Reverse) Breakdown Voltage: 510 V; (Reverse) Peak Pulse Current: 6000 A; Manufacturer Part Number: 820443211E; Category: Surge Protection; Match Code: WE-VD; ComponentLink1Description: Website Link; ComponentLink1URL: https://www.we-online.com/redexpert/article/820443211E?ad; ComponentLink2Description: Datasheet Link; ComponentLink2URL: https://www.we-online.com/redexpert/spec/820443211E?ad; Mount: Through Hole; Min Operating Temperature: -40 °C; Max Operating Temperature: 105 °C; Packaging: Tape and Reel; Width: 7.2 mm; Height: 20.5 mm; Diameter: 16.5 mm

## Nets that join several sheets
GND: HV power supply (14 pins), CPU (31 pins), Switch mode power supply (9 pins), Current sensors (21 pins)
GND_HV: HV power supply (C4.2 C5.2 D1.2), Switch mode power supply (8 pins), Current sensors (6 pins)
3.3V: HV power supply (C10.1 C11.1 IC1.2), CPU (21 pins)
5V: CPU (IC2.3), Current sensors (7 pins)
12V: HV power supply (K1.NO), Switch mode power supply (5 pins), Current sensors (C43.1 C44.1 IC5.3)
400VDC_BAT+: Switch mode power supply (C24.1 D4.1 L3.7 T1.4), Current sensors (7 pins)
ADC1_STM32: CPU (U1.12), Current sensors (C31.1 IC3.13 R24.1)
ADC2_STM32: CPU (U1.13), Current sensors (C36.1 IC4.13 R26.1)
ADC3_STM32: HV power supply (J8.6), CPU (U1.14)
BATTERY_STATE: HV power supply (J8.7), CPU (U1.10)
Buck-boost command: HV power supply (Q1.1), CPU (U1.49)
current_sensor_2: HV power supply (Q2.3), Current sensors (IC4.1 IC4.2 IC4.3 IC4.4)
ENABLE: HV power supply (J8.5), CPU (U1.23)
FAULT_N: HV power supply (J8.8), CPU (U1.52)
IP-1: HV power supply (C1.1 C2.1 C3.1 Q1.2), Current sensors (IC3.5 IC3.6 IC3.7 IC3.8)
OCF1_N: CPU (R7.1 U1.51), Current sensors (IC3.9)
OCF2_N: CPU (R28.2 U1.36), Current sensors (IC4.9)
PWM_U: HV power supply (J8.2), CPU (U1.38)
PWM_V: HV power supply (J8.3), CPU (U1.40)
PWM_W: HV power supply (J8.4), CPU (U1.41)
Relay_command: HV power supply (D2.C K1.A1), CPU (U1.50)
SPEED_IN: HV power supply (J8.1), CPU (U1.39)